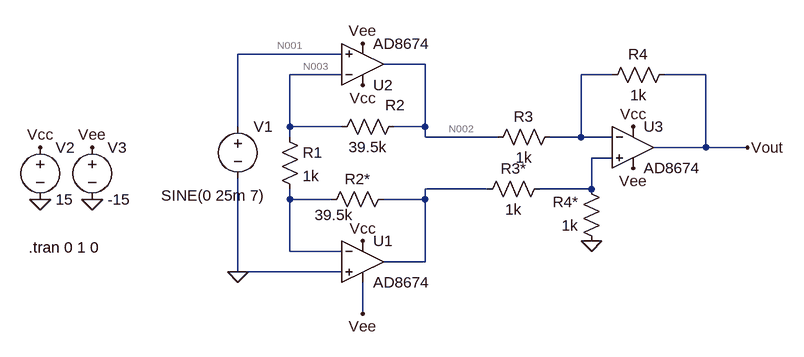
[diagram p0: schematic amplifier.asc]
amplifier.asc, the LTspice schematic file:
Version 4
SHEET 1 880 680
WIRE 48 -160 -112 -160
WIRE 176 -144 112 -144
WIRE 48 -128 -32 -128
WIRE 464 -128 416 -128
WIRE 608 -128 544 -128
WIRE -112 -48 -112 -160
WIRE -32 -48 -32 -128
WIRE 48 -48 -32 -48
WIRE 176 -48 176 -144
WIRE 176 -48 128 -48
WIRE -32 -32 -32 -48
WIRE 176 -32 176 -48
WIRE 288 -32 176 -32
WIRE 416 -32 416 -128
WIRE 416 -32 368 -32
WIRE 464 -32 416 -32
WIRE 608 -16 608 -128
WIRE 608 -16 528 -16
WIRE 672 -16 608 -16
WIRE 464 0 432 0
WIRE 272 48 176 48
WIRE 432 48 432 0
WIRE 432 48 352 48
WIRE -32 64 -32 48
WIRE 32 64 -32 64
WIRE 176 64 176 48
WIRE 176 64 112 64
WIRE -32 144 -32 64
WIRE 48 144 -32 144
WIRE 176 160 176 64
WIRE 176 160 112 160
WIRE -112 176 -112 32
WIRE 48 176 -112 176
WIRE 80 240 80 192
FLAG 432 128 0
FLAG -416 64 0
FLAG -336 64 0
FLAG -416 -16 Vcc
FLAG 80 -112 Vcc
FLAG 80 128 Vcc
FLAG 496 -48 Vcc
FLAG -336 -16 Vee
FLAG 80 -176 Vee
FLAG 80 240 Vee
FLAG 496 16 Vee
FLAG -112 176 0
FLAG 672 -16 Vout
SYMBOL OpAmps\\AD8674 80 96 R0
SYMATTR InstName U1
SYMBOL OpAmps\\AD8674 80 -80 M180
SYMATTR InstName U2
SYMBOL OpAmps\\AD8674 496 -80 R0
SYMATTR InstName U3
SYMBOL res -48 -48 R0
SYMATTR InstName R1
SYMATTR Value 1k
SYMBOL res 144 -64 R90
WINDOW 0 -2 14 VBottom 2
WINDOW 3 32 56 VTop 2
SYMATTR InstName R2
SYMATTR Value 39.5k
SYMBOL res 384 -48 R90
WINDOW 0 0 56 VBottom 2
WINDOW 3 32 56 VTop 2
SYMATTR InstName R3
SYMATTR Value 1k
SYMBOL res 560 -144 R90
WINDOW 0 0 56 VBottom 2
WINDOW 3 32 56 VTop 2
SYMATTR InstName R4
SYMATTR Value 1k
SYMBOL res 128 48 R90
WINDOW 0 0 56 VBottom 2
WINDOW 3 24 92 VTop 2
SYMATTR InstName R2*
SYMATTR Value 39.5k
SYMBOL res 368 32 R90
WINDOW 0 0 56 VBottom 2
WINDOW 3 32 56 VTop 2
SYMATTR InstName R3*
SYMATTR Value 1k
SYMBOL res 448 144 R180
WINDOW 0 36 76 Left 2
WINDOW 3 36 40 Left 2
SYMATTR InstName R4*
SYMATTR Value 1k
SYMBOL voltage -112 -64 R0
WINDOW 3 -118 122 Left 2
WINDOW 123 0 0 Left 0
WINDOW 39 0 0 Left 0
SYMATTR InstName V1
SYMATTR Value SINE(0 25m 7)
SYMBOL voltage -416 -32 R0
WINDOW 123 0 0 Left 0
WINDOW 39 0 0 Left 0
SYMATTR InstName V2
SYMATTR Value 15
SYMBOL voltage -336 -32 R0
WINDOW 123 0 0 Left 0
WINDOW 39 0 0 Left 0
SYMATTR InstName V3
SYMATTR Value -15
TEXT -434 138 Left 2 !.tran 0 1 0

The netlist it stands for:
* amplifier.asc
XU1 0 N007 Vcc Vee N006 AD8674  ; pins In+ In- V+ V- OUT
XU2 N001 N003 Vcc Vee N002 AD8674  ; pins In+ In- V+ V- OUT
XU3 N005 N004 Vcc Vee Vout AD8674  ; pins In+ In- V+ V- OUT
R1 N003 N007 1k
R2 N002 N003 39.5k
R3 N004 N002 1k
R4 Vout N004 1k
R2* N006 N007 39.5k
R3* N005 N006 1k
R4* 0 N005 1k
V1 N001 0 SINE(0 25m 7)
V2 Vcc 0 15
V3 Vee 0 -15
.tran 0 1 0
.backanno
.end

* Results of the author's LTspice run, read from the files saved beside the schematic
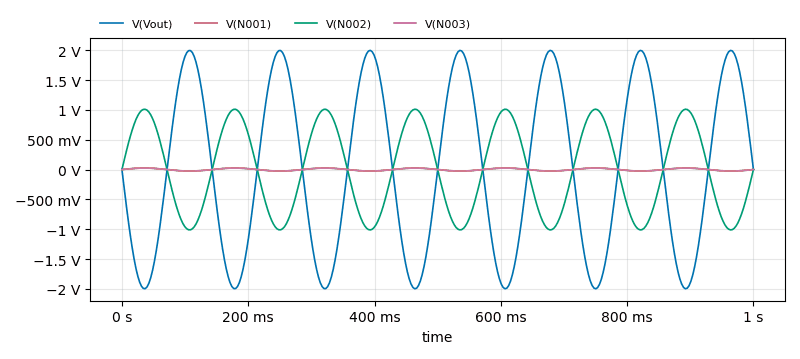
[diagram p1: Transient Analysis of amplifier.asc, plotted from the saved traces]
* Transient Analysis, 1 run:
*   V(Vout): min -1.999 V, max 1.998 V, average -527.2 µV, rms 1.413 V, last -425 µV
*   V(N001): min -25 mV, max 25 mV, average 4.615 nV, rms 17.68 mV, last 0 V
*   V(N002): min -1.012 V, max 1.012 V, average -198.3 µV, rms 715.5 mV, last -248.1 µV
*   V(N003): min -25.24 mV, max 24.72 mV, average -260.4 µV, rms 17.67 mV, last -261.1 µV